# EAGLE design imu_69 (EAGLE 9.6.2)
COMPANY: ADAFRUIT INDUSTRIES; DRAWN: KTOWN; REV: A
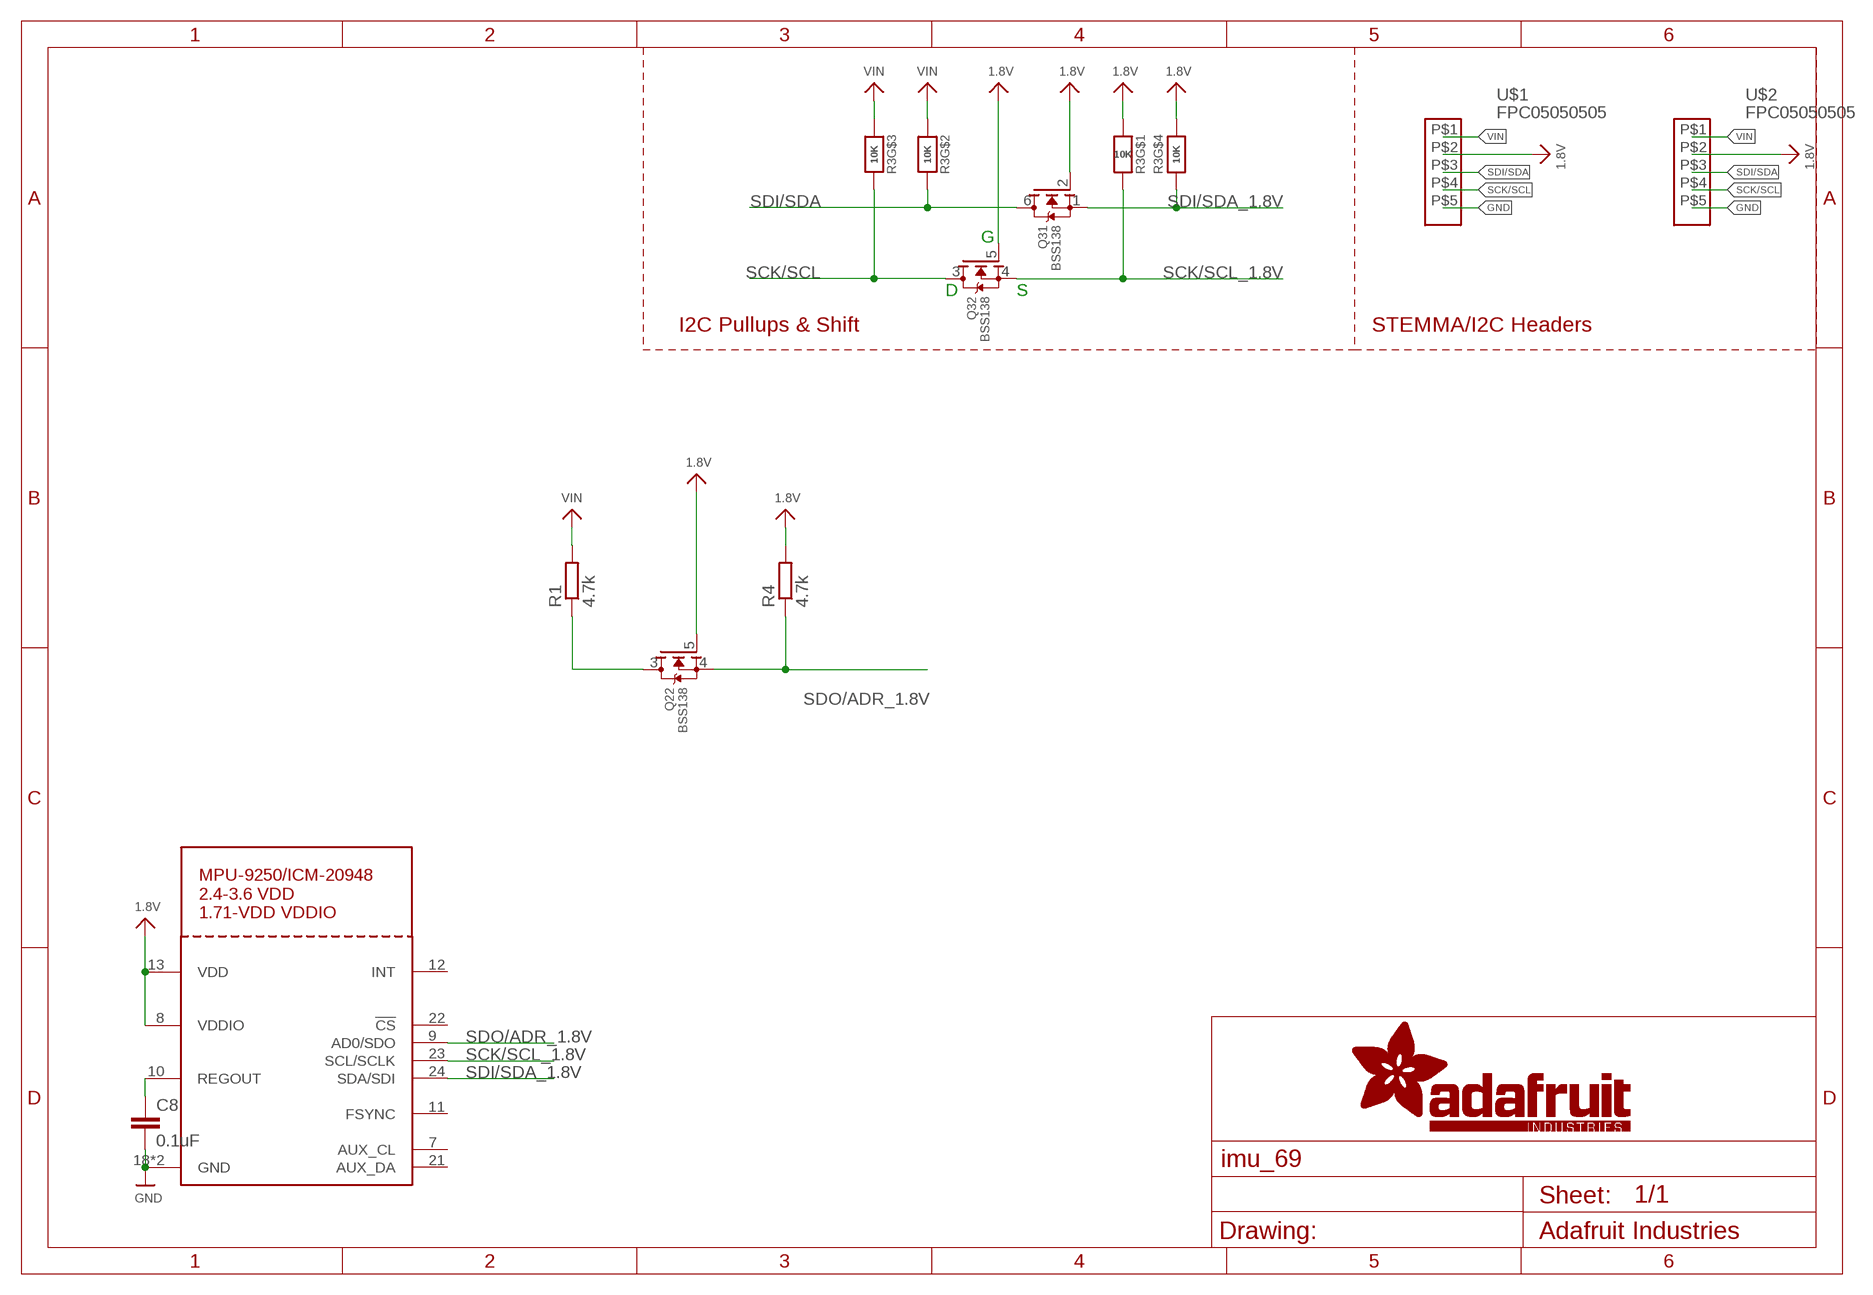
[diagram p0: schematic, sheet 1]

## Parts
C8  0.1uF  C-EUC0201  [C0201]
Q2  BSS138  MOSFET-N_DUAL  [SOT363]
Q3  BSS138  MOSFET-N_DUAL  [SOT363]
R1  4.7k  R-EU_R0402  [R0402]
R3  10K  RESISTOR_4PACK  [RESPACK_4X0603]
R4  4.7k  R-EU_R0402  [R0402]
U$1  FPC05050505  [FPB0505]
U$2  FPC05050505  [FPB0505]
U$21  MPU-9250_ICM20948  [QFN24_3MM_NOEP]

## Nets
1.8V: Q2.5(2:G) Q3.2(1:G) Q3.5(2:G) R3.4 R3.8 R4.2 U$1.P$2 U$2.P$2 U$21.8(VDDIO) U$21.13(VDD)
GND: C8.2 U$1.P$5 U$2.P$5 U$21.18(GND) U$21.20(GND)
REGOUT: C8.1 U$21.10(REGOUT)
SCK/SCL: Q3.3(2:D) R3.6 U$1.P$4 U$2.P$4
SCK/SCL_1.8V: Q3.4(2:S) R3.1 U$21.23(SCL/SCLK)
SDI/SDA: Q3.6(1:D) R3.7 U$1.P$3 U$2.P$3
SDI/SDA_1.8V: Q3.1(1:S) R3.5 U$21.24(SDA/SDI)
SDO/ADR: Q2.3(2:D) R1.1
SDO/ADR_1.8V: Q2.4(2:S) R4.1 U$21.9(AD0/SDO)
VIN: R1.2 R3.2 R3.3 U$1.P$1 U$2.P$1
Unconnected: Q2.1(1:S) Q2.2(1:G) Q2.6(1:D) U$21.7(AUX_CL) U$21.11(FSYNC) U$21.12(INT) U$21.21(AUX_DA) U$21.22(!CS)

## Notes on the sheet
- G
- D | S
- I2C Pullups & Shift | STEMMA/I2C Headers

## Library data of the parts
C8 = rcl:C-EU: CAPACITOR, European symbol; SPICEPREFIX: C
Q2 Q3 = microbuilder:MOSFET-N_DUAL: Dual N-Channel MOSFET SOT363 (2.0x1.25mm) 2N7002PS - 60V, 320mA [Digikey: 568-5984-1-ND]
R1 R4 = rcl:R-EU_: RESISTOR, European symbol; SPICEPREFIX: R
R3 = microbuilder:RESISTOR_4PACK: Resistor Packs (4 resistors) 4 x 0603 10K 1/16W - Digikey: YC164J-10KCT-ND
U$1 U$2 = my_library:FPC0505
U$21 = adafruit_sensor:MPU-9250: MPU-9250 3-Axis gyroscope and 3-Axis accelerometer

## Net classes
1 highpower: width 0.406 mm, drill 0.483 mm
2 lowpower: width 0.305 mm, drill 0.483 mm

## Board
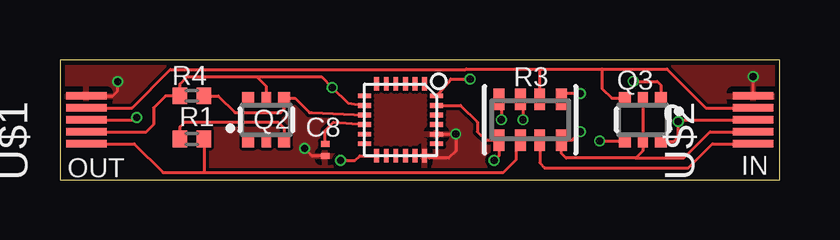
[diagram p1: board, top side]
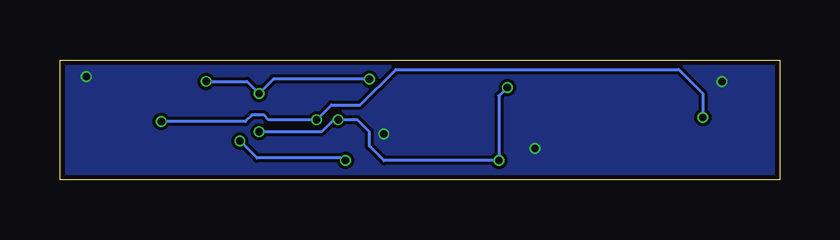
[diagram p2: board, bottom side, seen from below]

Size 30 x 5 mm. Coordinates in mm from the lower left corner, seen from the top.
Outline: 0,0 30,0 30,5 0,5 0,0
Copper layers (1*16): Top 0.035mm / dielectric 1.6mm / Bottom 0.035mm
Design rules "jlcpcb-2layers *": minimum track width 5mil, minimum drill 0.3mm, track to track 5mil, track to pad 5mil, pad to pad 5mil, via to via 5mil, smd to smd 5mil, copper to edge 0.2mm, drill to drill 6mil, minimum pad ring 10mil, minimum via ring 3mil, stop-mask expansion 4mil, vias tented up to drill 12mil, thermal gap 10mil

### Footprints (pad centres in the part's own frame; a part is rotated, then mirrored left to right if it is on the bottom)
C0201 = smd 0.25 x 0.35: 1 -0.25,0; 2 0.25,0
SOT363 = smd 0.5 x 0.5: 1 -0.75,-0.9; 3 0.75,-0.9; 4 0.75,0.9; 6 -0.75,0.9 | smd 0.4 x 0.5: 2 0,-0.9; 5 0,0.9
R0402 = smd 0.6 x 0.7: 1 -0.5,0; 2 0.5,0
RESPACK_4X0603 = smd 0.45 x 0.9: 1 -1.3,-0.85; 2 -0.4,-0.85; 3 0.4,-0.85; 4 1.3,-0.85; 5 1.3,0.85; 6 0.4,0.85; 7 -0.4,0.85; 8 -1.3,0.85
FPB0505 = smd 0.3 x 1.7: P$1 -1,0.1; P$2 -0.5,0.1; P$3 0,0.1; P$4 0.5,0.1; P$5 1,0.1
QFN24_3MM_NOEP = smd 0.55 x 0.2: 1 -1.5,1; 2 -1.5,0.6; 3 -1.5,0.2; 4 -1.5,-0.2; 5 -1.5,-0.6; 6 -1.5,-1; 13 1.5,-1; 14 1.5,-0.6; 15 1.5,-0.2; 16 1.5,0.2; 17 1.5,0.6; 18 1.5,1 | smd 0.2 x 0.55: 7 -1,-1.5; 8 -0.6,-1.5; 9 -0.2,-1.5; 10 0.2,-1.5; 11 0.6,-1.5; 12 1,-1.5; 19 1,1.5; 20 0.6,1.5; 21 0.2,1.5; 22 -0.2,1.5; 23 -0.6,1.5; 24 -1,1.5

### Placement (x,y rotation side)
C8  11.06,1.23 270 top
Q2  8.6,2.5 0 top
Q3  24.3,2.5 180 top
R1  5.5,1.7 0 top
R3  19.6,2.5 0 top
R4  5.5,3.5 180 top
U$1  1.2,2.5 90 top
U$2  29,2.5 90 top
U$21  14.2,2.5 270 top

### Tracks (layer width: path | path; a pad name or v marks a point on that pad's centre or on a via)
1.8V  (via drill 0.3)
  Top 0.127: Q3.2 Q3.5 24.3,1.2 24,0.9 | 24,0.9 21.1,0.9 20.9,1.1 R3.4 21.35,1.65 v21.7,2 | 24,0.9 26,0.9 27.1,2 U$2.P$2 | 8.2,4.3 5.3,4.3 5,4 R4.2 4.4,3.5 3.9,3 3.9,2.3 3.6,2 U$1.P$2 | 8.2,4.3 8.6,3.9 Q2.5 | 8.2,4.3 10.9,4.3 v11.35,3.85 12,3.2 U$21.8 | v11.7,0.8 12.3,0.8 12.5,1 U$21.13 | R3.8 18.4,3.25 v18.4,2.5
  Bottom 0.127: v21.7,2 19.1,2 18.6,2.5 v18.4,2.5 17.6,2.5 17.1,2 17.1,1.4 16.5,0.8 v11.7,0.8 11.7,3.5 v11.35,3.85
GND  (via drill 0.3)
  Top 0.127: U$21.18 15.4,0.9 16.2,0.9 16.5,1.2 v16.5,1.9 U$21.20 | C8.2 10.52,0.98 v10.2,1.3 | U$1.P$5 2.2,3.5 2.4,3.7 v2.4,4.1 | U$2.P$5 v28.9,4.3
  pour Top: 0,5 30,5 30,0 0,0
  pour Bottom: 0,5 30,5 30,0 0,0
REGOUT
  Top 0.127: C8.1 11.06,2.06 11.4,2.4 U$21.10
SCK/SCL
  Top 0.127: 20,4.62 16.93,4.62 16.91,4.6 4.6,4.6 3,3 U$1.P$4 | 20,4.62 22.6,4.62 | 22.6,4.62 25.3,4.62 26.92,3 U$2.P$4 | R3.6 20,4.62 | 22.6,4.62 22.6,3.8 23,3.4 Q3.3
SCK/SCL_1.8V  (via drill 0.3)
  Top 0.127: 18.3,1.3 R3.1 | R3.1 18.3,1 v18.1,0.8 | U$21.23 16.7,3.1 17.4,2.4 17.4,2 17.75,1.65 R3.1 | v22.5,1.62 23.53,1.62 Q3.4
  Bottom 0.127: v22.5,1.62 21.78,0.9 18.2,0.9 v18.1,0.8
SDI/SDA  (via drill 0.3)
  Top 0.127: R3.7 19.3,3.45 v19.3,2.5 | v3.2,2.6 3.1,2.5 U$1.P$3 | Q3.6 25.6,1.6 25.77,1.77 v25.77,2.42 25.85,2.5 U$2.P$3
  Bottom 0.127: v25.77,2.42 22.27,2.42 22,2.7 21.5,2.7 21.3,2.5 v19.3,2.5 18.68,3.12 17.48,3.12 16,4.6 4.2,4.6 3.2,3.6 v3.2,2.6
SDI/SDA_1.8V  (via drill 0.3)
  Top 0.127: v21.7,3.6 20.95,3.6 R3.5 | U$21.24 16.3,4.2 v17.1,4.2 | Q3.1 25.05,3.95 24.9,4.1 v23.9,4.1
  Bottom 0.127: v23.9,4.1 22.2,4.1 v21.7,3.6 21.1,4.2 v17.1,4.2
SDO/ADR
  Top 0.127: Q2.3 9.35,2.15 9.1,2.4 5.2,2.4 5,2.2 R1.1
SDO/ADR_1.8V
  Top 0.127: R4.1 6.6,3.5 7.3,2.8 9.2,2.8 9.35,2.95 Q2.4 9.8,3.4 10.4,2.8 10.5,2.8 U$21.9
VIN
  Top 0.127: 6,0.3 18.49,0.3 19.02,0.83 19.02,1.67 R3.2 R3.3 20,0.7 20.2,0.5 26.2,0.5 26.95,1.25 27,1.3 27.2,1.5 U$2.P$1 | 6,0.3 4.3,0.3 3.1,1.5 U$1.P$1 | R1.2 6,0.3

### Text on the board
tPlace: OUT | IN